# Altium schematic sheet Sheet3.SchDoc
size A4
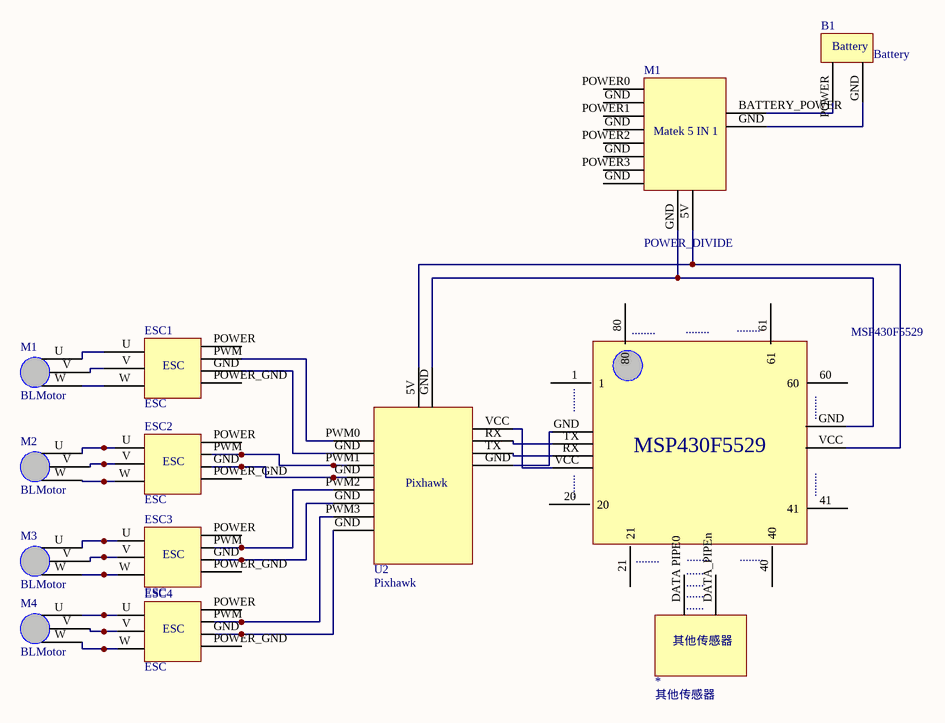
[diagram p0: Sheet3.SchDoc]

## Parts
(Parts that share a designator on the sheet are numbered #1, #2 ... from top to bottom, then left to right.)
*  其他传感器
B1  Battery
ESC1  ESC
ESC2  ESC
ESC3  ESC
ESC4  ESC
M1#1  POWER_DIVIDE
M1#2  BLMotor
M2  BLMotor
M3  BLMotor
M4  BLMotor
U2  Pixhawk
  MSP430F5529

## Nets
NetB1_GND: B1.GND M1#1.GND
NetB1_POWER: B1.POWER M1#1.BATTERY_POWER
NetESC1_GND: ESC1.GND U2.GND
NetESC1_PWM: ESC1.PWM U2.PWM0
NetESC1_U: ESC1.U M1#2.U
NetESC1_V: ESC1.V M1#2.V
NetESC1_W: ESC1.W M1#2.W
NetESC2_GND: ESC2.GND U2.GND
NetESC2_PWM: ESC2.PWM U2.PWM1
NetESC2_U: ESC2.U M2.U
NetESC2_V: ESC2.V M2.V
NetESC2_W: ESC2.W M2.W
NetESC3_GND: ESC3.GND U2.GND
NetESC3_PWM: ESC3.PWM U2.PWM2
NetESC3_U: ESC3.U M3.U
NetESC3_V: ESC3.V M3.V
NetESC3_W: ESC3.W M3.W
NetESC4_GND: ESC4.GND U2.GND
NetESC4_PWM: ESC4.PWM U2.PWM3
NetESC4_U: ESC4.U M4.U
NetESC4_V: ESC4.V M4.V
NetESC4_W: ESC4.W M4.W
NetM1#1_5V: M1#1.5V U2.5V .VCC
NetM1#1_GND: M1#1.GND U2.GND .GND
NetU2_GND: U2.GND .GND
NetU2_RX: U2.RX .TX
NetU2_TX: U2.TX .RX
NetU2_VCC: U2.VCC .VCC

Not connected (* = marked no-connect by the designer): * DATA PIPE0(98) DATA_PIPEn(99); ESC1 POWER(86) POWER_GND(87); ESC2 POWER(86) POWER_GND(87); ESC3 POWER(86) POWER_GND(87); ESC4 POWER(86) POWER_GND(87); M1#1 POWER0(90) POWER1(92) POWER2(90) POWER3(92);  1 20 21 40 41 60 61 80

## Notes on the sheet
- (in symbol MSP430F5529) ........
- (in symbol POWER_DIVIDE) Matek 5 IN 1
- (in symbol 其他传感器) ......